# EasyEDA schematic SCH_chimenea_2022-03-22.json
TITLE: Sheet_1; REV: 1.0; Date: 2022-03-22; Sheet: 1/1; Drawn By: Andr3s199609; Company: Your Company
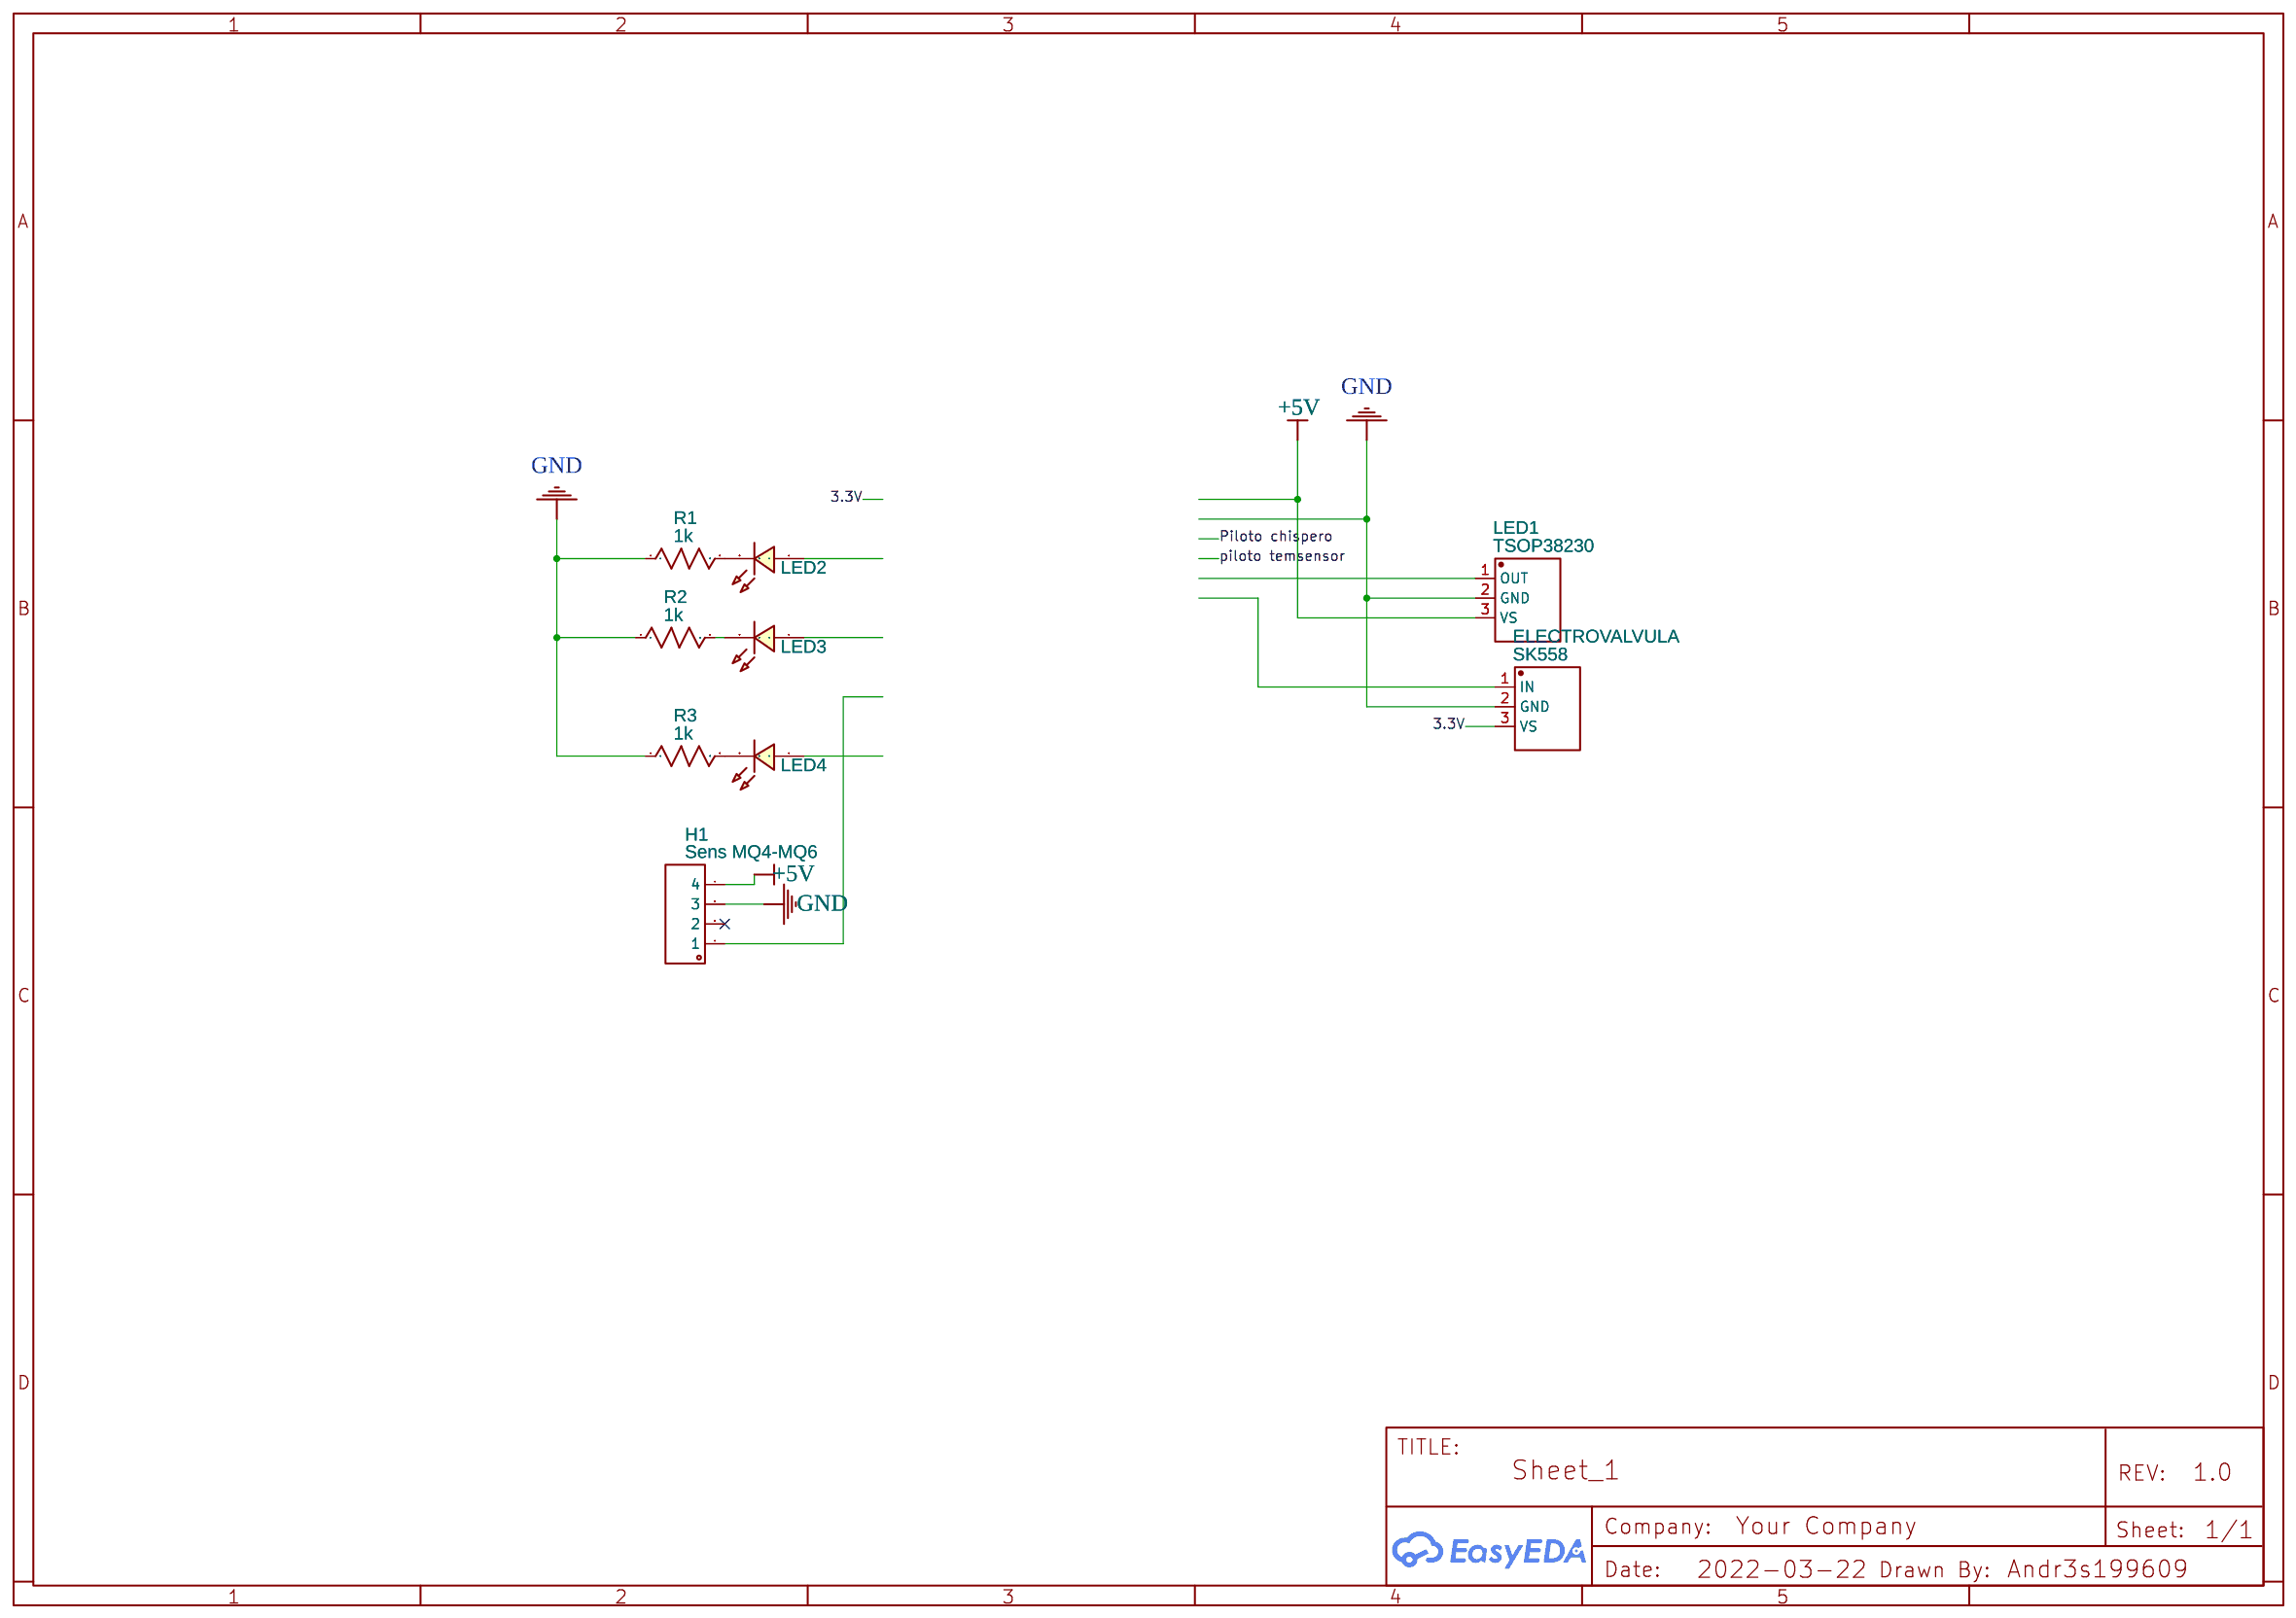
[diagram p0: schematic sheet]

## Parts
ELECTROVALVULA  SK558  [SENSOR-TG_TSOP38236]
H1  Sens MQ4-MQ6  [DIP-1X4P-2.54MM-M]
LED1  TSOP38230  [SENSOR-TG_TSOP38236]
LED2  LED-0603_R  [LED0603_RED]
LED3  LED-0603_R  [LED0603_RED]
LED4  LED-0603_R  [LED0603_RED]
R1  1k  [R0603]
R2  1k  [R0603]
R3  1k  [R0603]

## Library data of the parts
ELECTROVALVULA LED1 = TSOP38238: Supplier: LCSC; Manufacturer: VISHAY; Contributor: LCSC; Supplier Part: C141632; JLCPCB Part Class: Extended Part
H1 = -: Supplier Part: C124378; Supplier: LCSC; Manufacturer: Ckmtw; Manufacturer Part: 210S-1*4P L=11.6MMGold-plated black; Contributor: LCSC
LED2-LED4 = LED-0603_R: Manufacturer: EVERLIGHT(台湾亿光); Manufacturer Part: 19-217/R6C-AL1M2VY/3T; Supplier Part: C72044; Supplier: LCSC; Contributor: LCEDA_01
R1-R3 = R_0603_US: Contributor: LCEDA_Lib

## Nets
3.3V: ELECTROVALVULA.3(VS)
+5V: H1.4 LED1.3(VS)
GND: ELECTROVALVULA.2(GND) H1.3 LED1.2(GND) R1.1 R2.1 R3.1
Net-(LED2-2): LED2.2 R1.2
Net-(LED3-2): LED3.2 R2.2
Net-(LED4-2): LED4.2 R3.2

Not connected (* = marked no-connect by the designer): ELECTROVALVULA 1(IN); H1 1 2*; LED1 1(OUT); LED2 1; LED3 1; LED4 1
